# EAGLE design Xbee abajo (EAGLE 9.3.1)
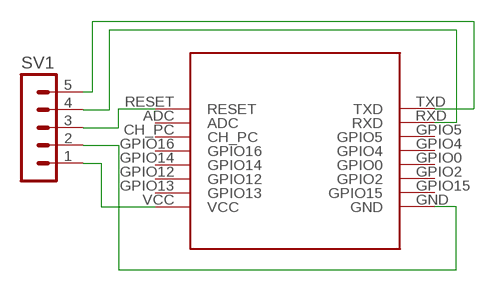
[diagram p0: schematic, sheet 1]

## Parts
SV1  MA05-1  [MA05-1]
U$3  ESP07  [ESP07]

## Nets
N$2: SV1.2 U$3.GND
N$3: SV1.3 U$3.RESET
N$4: SV1.4 U$3.RXD
N$5: SV1.5 U$3.TXD
N$6: SV1.1 U$3.VCC
Unconnected: U$3.ADC U$3.CH_PC U$3.GPIO0 U$3.GPIO2 U$3.GPIO4 U$3.GPIO5 U$3.GPIO12 U$3.GPIO13 U$3.GPIO14 U$3.GPIO15 U$3.GPIO16

## Library data of the parts
SV1 = con-lstb:MA05-1: PIN HEADER; OC_FARNELL: unknown; OC_NEWARK: unknown
U$3 = ESP07:ESP07

## Board
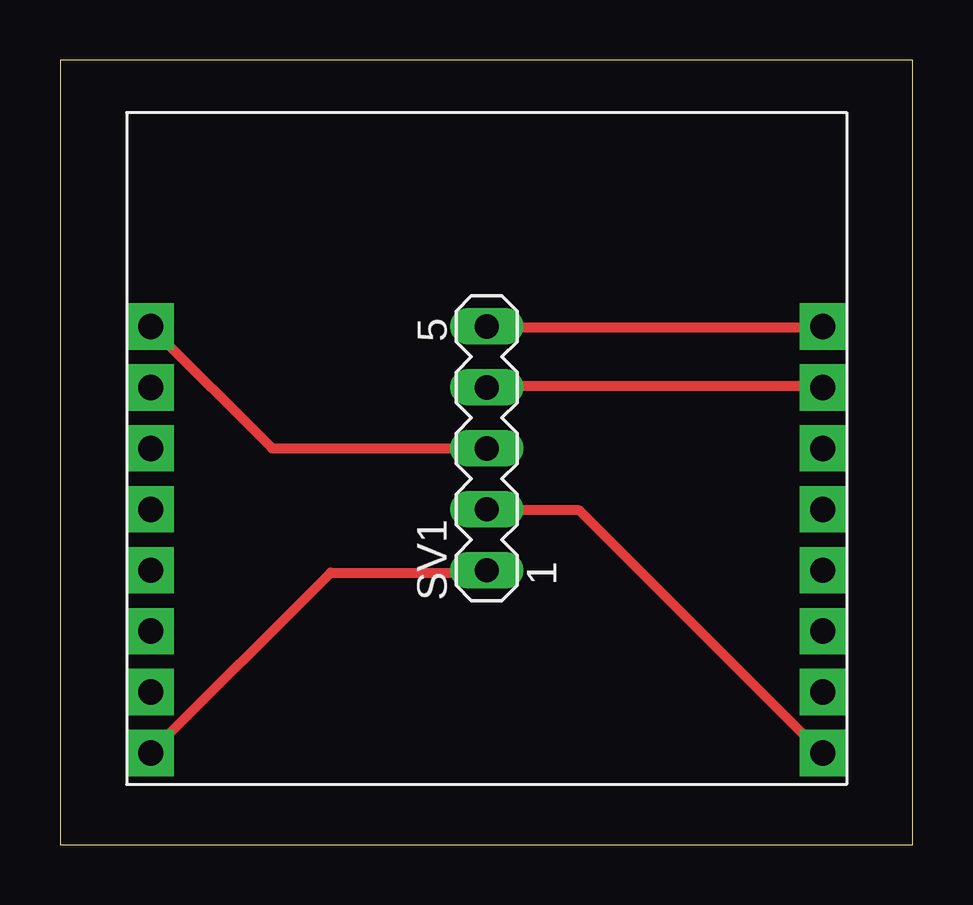
[diagram p1: board, top side]

Size 35.54 x 32.69 mm. Coordinates in mm from the lower left corner, seen from the top.
Outline: 0,0 35.54,0 35.54,32.69 0,32.69 0,0
Copper layers (1*16): Top 0.035mm / dielectric 1.5mm / Bottom 0.035mm
Design rules "default": minimum track width 6mil, minimum drill 0.35mm, track to track 6mil, track to pad 6mil, pad to pad 6mil, via to via 6mil, smd to smd 6mil, copper to edge 40mil, drill to drill 6mil, minimum pad ring 10mil, minimum via ring 8mil, stop-mask expansion 4mil, vias tented up to drill 0mil, thermal gap 10mil

### Footprints (pad centres in the part's own frame; a part is rotated, then mirrored left to right if it is on the bottom)
MA05-1 = drill 1.016 long: 1 -5.08,0; 2 -2.54,0; 3 0,0; 4 2.54,0; 5 5.08,0
ESP07 = drill 1.06 pad 1.93 square: ADC -14,2.54; CH_PC -14,0; GND 14,-12.7; GPIO0 14,-5.08; GPIO2 14,-7.62; GPIO4 14,-2.54; GPIO5 14,0; GPIO12 -14,-7.62; GPIO13 -14,-10.16; GPIO14 -14,-5.08; GPIO15 14,-10.16; GPIO16 -14,-2.54; RESET -14,5.08; RXD 14,2.54; TXD 14,5.08; VCC -14,-12.7

### Placement (x,y rotation side)
SV1  17.78,16.51 90 top
U$3  17.78,16.51 0 top

### Tracks (layer width: path | path; a pad name or v marks a point on that pad's centre or on a via)
N$2
  Top 0.152: 17.83,13.92 SV1.2 | 31.7,3.86 U$3.GND
  Top 0.406: 17.83,13.92 21.64,13.92 31.7,3.86
N$3
  Top 0.152: 3.81,21.54 U$3.RESET
  Top 0.406: SV1.3 8.84,16.51 3.81,21.54
N$4
  Top 0.152: 17.83,19.1 SV1.4 | 31.7,19.1 U$3.RXD
  Top 0.406: 31.7,19.1 17.83,19.1
N$5
  Top 0.152: 17.83,21.54 SV1.5 | 31.7,21.54 U$3.TXD
  Top 0.406: 31.7,21.54 17.83,21.54
N$6
  Top 0.152: 17.68,11.33 SV1.1 | 3.81,3.86 U$3.VCC
  Top 0.406: 17.68,11.33 11.28,11.33 3.81,3.86